# EAGLE schematic blank half eurocard (EAGLE 9.6.2)
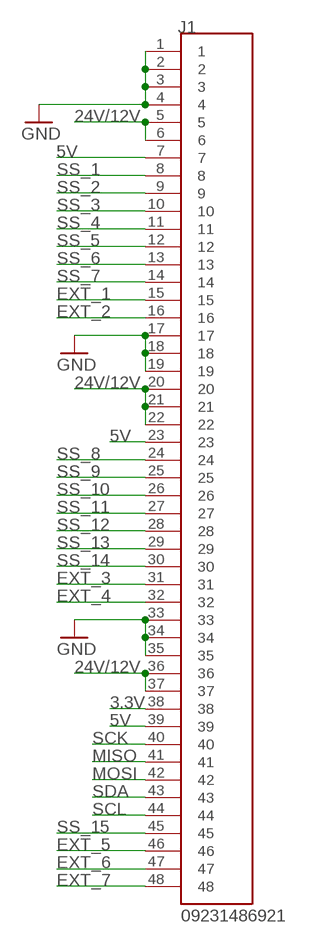
[diagram p0: schematic, sheet 1]

## Parts
J1  09231486921  [HARTING_09231486921]

## Nets
3.3V: J1.38
5V: J1.7 J1.23 J1.39
24V/12V: J1.5 J1.6 J1.20 J1.21 J1.22 J1.36 J1.37
EXT_1: J1.15
EXT_2: J1.16
EXT_3: J1.31
EXT_4: J1.32
EXT_5: J1.46
EXT_6: J1.47
EXT_7: J1.48
GND: J1.1 J1.2 J1.3 J1.4 J1.17 J1.18 J1.19 J1.33 J1.34 J1.35
MISO: J1.41
MOSI: J1.42
SCK: J1.40
SCL: J1.44
SDA: J1.43
SS_1: J1.8
SS_2: J1.9
SS_3: J1.10
SS_4: J1.11
SS_5: J1.12
SS_6: J1.13
SS_7: J1.14
SS_8: J1.24
SS_9: J1.25
SS_10: J1.26
SS_11: J1.27
SS_12: J1.28
SS_13: J1.29
SS_14: J1.30
SS_15: J1.45

## Library data of the parts
J1 = din41612_48_pin_board:09231486921: Check prices <https://pricing.snapeda.com/parts/8-1393644-0/TE%20Connectivity/view-part?ref=eda>; AVAILABILITY: In Stock; COMMENT: 09231486921; DESCRIPTION: Conn DIN 41612 M 48 POS 2.54mm Solder RA Thru-Hole Tray; EU_ROHS_COMPLIANCE: Compliant; MF: HARTING; MP: 09231486921; PACKAGE: None; PRICE: 6$; PURCHASE-URL-DIGIKEY: https://www.digikey.ca/en/products/detail/harting/09231486921/3180439